# EAGLE design Rocket4Narrow (EAGLE 9.3.2)
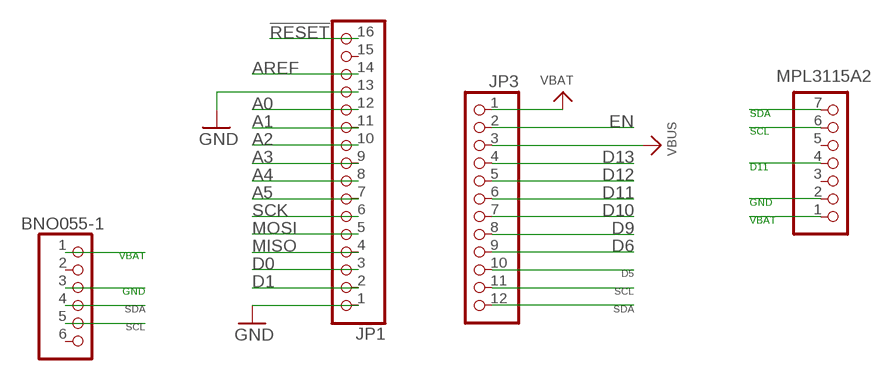
[diagram p0: schematic, sheet 1]

## Parts
BNO055-1  HEADER-1X670MIL  [1X06_ROUND_70]
JP1  HEADER-1X16ROUND  [1X16_ROUND]
JP3  HEADER-1X12  [1X12_ROUND]
MPL3115A2  HEADER-1X770MIL  [1X07_ROUND_70]

## Nets
!RESET: JP1.16
A0: JP1.12
A1: JP1.11
A2: JP1.10
A3: JP1.9
A4: JP1.8
A5: JP1.7
AREF: JP1.14
D0: JP1.3
D1: JP1.2
D5: JP3.10
D6: JP3.9
D9: JP3.8
D10: JP3.7
D11: JP3.6 MPL3115A2.4
D12: JP3.5
D13: JP3.4
EN: JP3.2
GND [Supply]: BNO055-1.3 JP1.1 JP1.13 MPL3115A2.2
MISO: JP1.4
MOSI: JP1.5
SCK: JP1.6
SCL: BNO055-1.5 JP3.11 MPL3115A2.6
SDA: BNO055-1.4 JP3.12 MPL3115A2.7
VBAT [Supply]: BNO055-1.1 JP3.1 MPL3115A2.1
VBUS: JP3.3
Unconnected: BNO055-1.2 BNO055-1.6 JP1.15 MPL3115A2.3 MPL3115A2.5

## Library data of the parts
BNO055-1 = microbuilder:HEADER-1X6: PIN HEADER
JP1 = microbuilder:HEADER-1X16: PIN HEADER
JP3 = microbuilder:HEADER-1X12
MPL3115A2 = microbuilder:HEADER-1X7: PIN HEADER

## Net classes
0 default: clearance 0.205 mm
1 Supply: width 0.381 mm

## Board
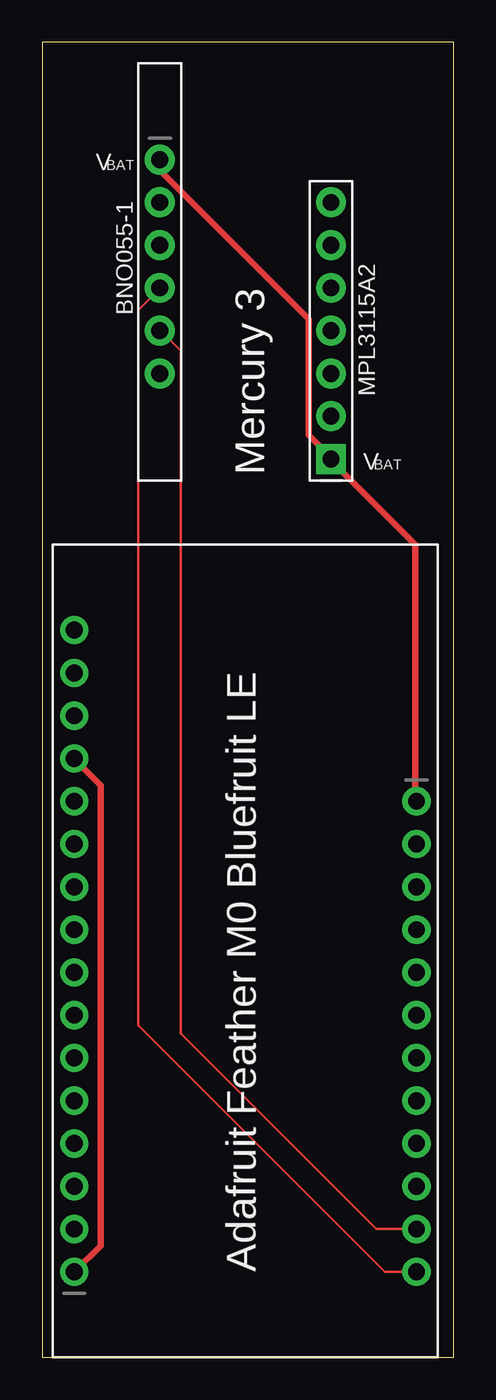
[diagram p1: board, top side]
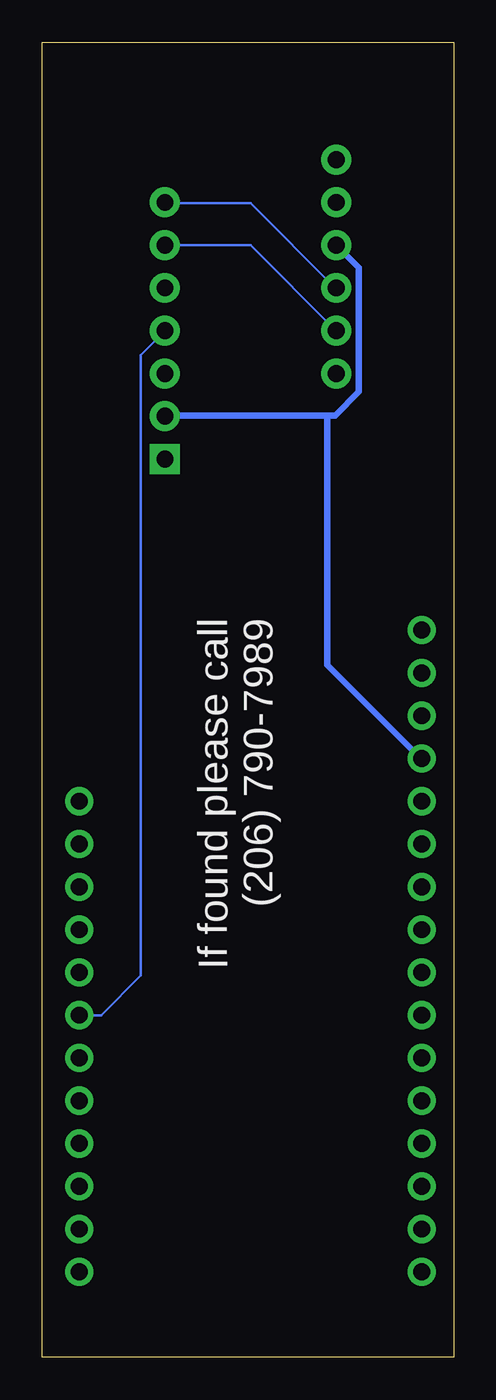
[diagram p2: board, bottom side, seen from below]

Size 24.43 x 78.09 mm. Coordinates in mm from the lower left corner, seen from the top.
Outline: 0,0 24.43,0 24.43,78.09 0,78.09 0,0
Copper layers (1*16): Top 0.035mm / dielectric 1.5mm / Bottom 0.035mm
Design rules "default": minimum track width 6mil, minimum drill 0.35mm, track to track 6mil, track to pad 6mil, pad to pad 6mil, via to via 6mil, smd to smd 6mil, copper to edge 40mil, drill to drill 6mil, minimum pad ring 10mil, minimum via ring 8mil, stop-mask expansion 4mil, vias tented up to drill 0mil, thermal gap 10mil

### Footprints (pad centres in the part's own frame; a part is rotated, then mirrored left to right if it is on the bottom)
1X06_ROUND_70 = drill 1 pad 1.778: 1 -6.35,0; 2 -3.81,0; 3 -1.27,0; 4 1.27,0; 5 3.81,0; 6 6.35,0
1X16_ROUND = drill 1 pad 1.676: 1 -19.05,0; 2 -16.51,0; 3 -13.97,0; 4 -11.43,0; 5 -8.89,0; 6 -6.35,0; 7 -3.81,0; 8 -1.27,0; 9 1.27,0; 10 3.81,0; 11 6.35,0; 12 8.89,0; 13 11.43,0; 14 13.97,0; 15 16.51,0; 16 19.05,0
1X12_ROUND = drill 1 pad 1.676: 1 -13.97,0; 2 -11.43,0; 3 -8.89,0; 4 -6.35,0; 5 -3.81,0; 6 -1.27,0; 7 1.27,0; 8 3.81,0; 9 6.35,0; 10 8.89,0; 11 11.43,0; 12 13.97,0
1X07_ROUND_70 = drill 1 pad 1.778 square: 1 -7.62,0 | drill 1 pad 1.778: 2 -5.08,0; 3 -2.54,0; 4 0,0; 5 2.54,0; 6 5.08,0; 7 7.62,0

### Placement (x,y rotation side)
BNO055-1  6.99,64.77 270 top
JP1  1.91,24.13 90 top
JP3  22.23,19.05 270 top
MPL3115A2  17.14,60.96 90 top

### Tracks (layer width: path | path; a pad name or v marks a point on that pad's centre or on a via)
D11
  Bottom 0.152: JP3.6 20.92,20.32 18.57,22.67 18.57,59.52 17.16,60.94 MPL3115A2.4
GND
  Top 0.381: JP1.1 1.97,5.09 1.97,5.13 3.47,6.64 3.47,33.97 1.97,35.47 JP1.13
  Bottom 0.381: 7.59,55.93 7.04,55.93 5.63,57.34 5.63,64.69 6.97,66.03 BNO055-1.3 | 7.59,55.93 17.07,55.93 MPL3115A2.2 | 7.59,55.93 7.5,55.75 7.5,41.1 1.97,35.56 JP1.13
SCL
  Top 0.152: JP3.11 19.84,7.62 8.22,19.23 8.22,59.77 7.06,60.94 BNO055-1.5
  Bottom 0.152: MPL3115A2.6 17.07,66.03 12.06,66.03 7.06,61.03 BNO055-1.5
SDA
  Top 0.152: JP3.12 20.34,5.08 5.71,19.72 5.71,62.17 6.97,63.44 BNO055-1.4
  Bottom 0.152: MPL3115A2.7 17.07,68.53 12.06,68.53 7.06,63.53 BNO055-1.4
VBAT
  Top 0.381: JP3.1 22.16,33.06 22.16,48.25 17.16,53.25 MPL3115A2.1 17.07,53.52 15.81,54.77 15.81,61.65 7.06,70.41 7.06,71.03 BNO055-1.1

### Text on the board
tPlace: V | BAT | Mercury 3 | V | BAT | Adafruit Feather M0 Bluefruit LE
bPlace: If found please call / (206) 790-7989